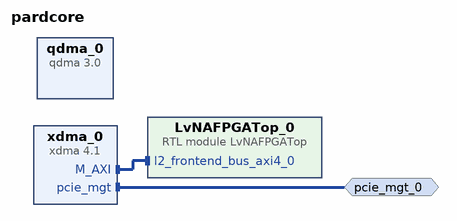
[diagram p0: block diagram of the top level]
# Vivado block design pardcore, xcu280-fsvh2892-2L-e, Vivado 2019.1
create_bd_design pardcore

create_bd_intf_port -mode Master -vlnv xilinx.com:interface:pcie_7x_mgt_rtl:1.0 pcie_mgt_0

create_bd_cell -type module -reference LvNAFPGATop LvNAFPGATop_0
create_bd_cell -type ip -vlnv xilinx.com:ip:xdma:4.1 xdma_0
set_property -dict [list \
  CONFIG.PF0_DEVICE_ID_mqdma 9011 \
  CONFIG.PF2_DEVICE_ID_mqdma 9011 \
  CONFIG.PF3_DEVICE_ID_mqdma 9011 \
  CONFIG.axi_bypass_64bit_en false \
  CONFIG.axi_data_width 64_bit \
  CONFIG.axilite_master_en false \
  CONFIG.axist_bypass_en true \
  CONFIG.functional_mode DMA \
  CONFIG.mode_selection Advanced \
  CONFIG.pf0_device_id 9011 \
  CONFIG.pl_link_cap_max_link_width X1 \
  CONFIG.xdma_axilite_slave false \
] [get_bd_cells xdma_0]
create_bd_cell -type ip -vlnv xilinx.com:ip:qdma:3.0 qdma_0

# ---- connections ----

connect_bd_intf_net [get_bd_intf_ports pcie_mgt_0] [get_bd_intf_pins xdma_0/pcie_mgt]
connect_bd_intf_net [get_bd_intf_pins xdma_0/M_AXI] [get_bd_intf_pins LvNAFPGATop_0/l2_frontend_bus_axi4_0]

validate_bd_design
save_bd_design
